# EAGLE schematic Joulev2_RealTime (EAGLE 8.1.1)

## Sheet 1 of 3
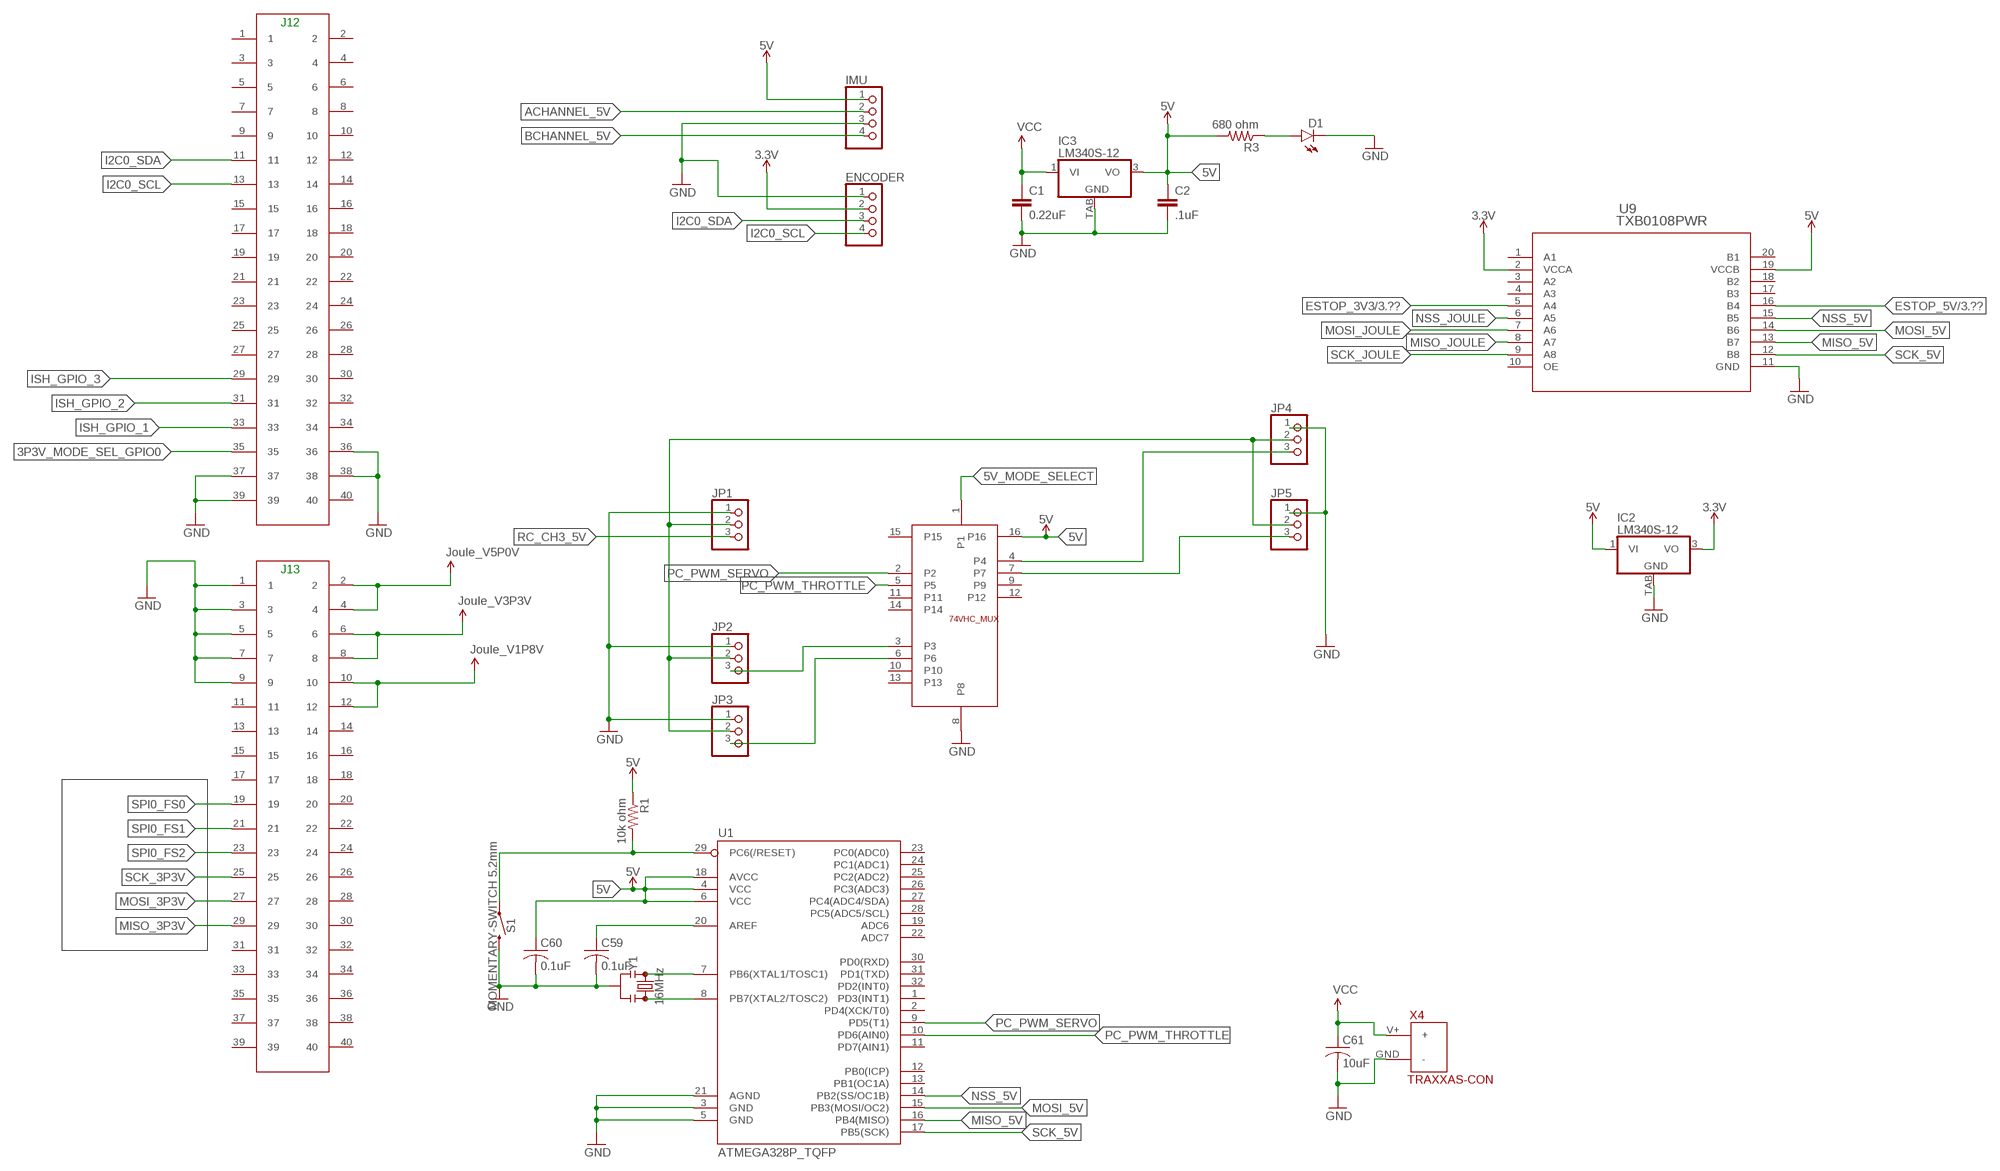
[diagram p0: schematic, sheet 1]

### Parts
C1  0.22uF  0.22UF-25V-10%(0603)  [0603-CAP]
C2  .1uF  0.22UF-25V-10%(0603)  [0603-CAP]
C59  0.1uF  C-USC0603  [C0603]
C60  0.1uF  C-USC0603  [C0603]
C61  10uF  C-USC0603  [C0603]
D1  LED0603  [LED-0603]
ENCODER  PINHD-1X4  [1X04]
IC2  LM340S-12  [TO263-3]
IC3  LM340S-12  [TO263-3]
IMU  PINHD-1X4  [1X04]
JP1  PINHD-1X3  [1X03]
JP2  PINHD-1X3  [1X03]
JP3  PINHD-1X3  [1X03]
JP4  PINHD-1X3  [1X03]
JP5  PINHD-1X3  [1X03]
R1  10k ohm  R-US_R0603  [R0603]
R3  680 ohm  R-US_R0603  [R0603]
S1  MOMENTARY-SWITCH 5.2mm  MOMENTARY-SWITCH-SPST-SMD-5.2MM  [TACTILE_SWITCH_SMD_5.2MM]
U1  ATMEGA328P_TQFP  [TQFP32-08]
U2  74VHC_MUXSO16  [SO16]
U9  TXB0108PWR  [PW20]
X1  J12HEADER_(JOULE)  [2X20]
X2  J13HEADER_(JOULE)  [2X20]
X4  TRAXXAS-CON  [TRAXXAS-CON]
Y1  16MHz  RESONATOR-16MHZSMD_3.2X1.3  [RESONATOR-SMD-3.2X1.3]

### Nets
3.3V: ENCODER.2 IC2.3(VO) U9.2(VCCA) ; also sheet 2,3
3P3V_MODE_SEL_GPIO0: X1.35
5V: C2.1 C60.1 IC2.1(VI) IC3.3(VO) IMU.1 R1.1 R3.2 U1.4(VCC) U1.6(VCC) U1.18(AVCC) U2.16 U9.19(VCCB)
5V_MODE_SELECT: U2.1
ACHANNEL_5V: IMU.2
BCHANNEL_5V: IMU.4
ESTOP_3V3: U9.5(A4) ; also sheet 3
ESTOP_5V: U9.16(B4) ; also sheet 3
GND: C1.2 C2.2 C59.2 C60.2 C61.2 D1.C ENCODER.1 IC2.TAB(GND) IC3.TAB(GND) IMU.3 JP1.1 JP2.1 JP3.1 JP4.1 JP5.1 S1.3 U1.3(GND) U1.5(GND) U1.21(AGND) U2.8 U9.11(GND) X1.36 X1.37 X1.38 X1.39 X2.1 X2.3 X2.5 X2.7 X2.9 X4.GND(-) Y1.2 ; also sheet 2,3
I2C0_SCL: ENCODER.4 X1.13
I2C0_SDA: ENCODER.3 X1.11
ISH_GPIO_1: X1.33
ISH_GPIO_2: X1.31
ISH_GPIO_3: X1.29
MISO_3P3V: X2.29
MISO_5V: U1.16(PB4(MISO)) U9.13(B7)
MISO_JOULE: U9.8(A7)
MOSI_3P3V: X2.27
MOSI_5V: U1.15(PB3(MOSI/OC2)) U9.14(B6)
MOSI_JOULE: U9.7(A6)
N$2: JP4.3 U2.4
N$3: JP5.3 U2.7
N$4: R1.2 S1.1 U1.29(PC6(/RESET))
N$6: U1.7(PB6(XTAL1/TOSC1)) Y1.1
N$7: JP1.2 JP2.2 JP3.2 JP4.2 JP5.2
N$8: U1.8(PB7(XTAL2/TOSC2)) Y1.3
N$10: JP2.3 U2.3
N$11: JP3.3 U2.6
N$13: C59.1 U1.20(AREF)
N$20: D1.A R3.1
NSS_5V: U1.14(PB2(SS/OC1B)) U9.15(B5)
NSS_JOULE: U9.6(A5)
PC_PWM_SERVO: U1.9(PD5(T1)) U2.2
PC_PWM_THROTTLE: U1.10(PD6(AIN0)) U2.5
RC_CH3_5V: JP1.3
SCK_3P3V: X2.25
SCK_5V: U1.17(PB5(SCK)) U9.12(B8)
SCK_JOULE: U9.9(A8)
SPI0_FS0: X2.19
SPI0_FS1: X2.21
SPI0_FS2: X2.23
V1P8V: X2.10 X2.12 ; supply symbol labelled Joule_V1P8V
V3P3V: X2.6 X2.8 ; supply symbol labelled Joule_V3P3V
V5P0V: X2.2 X2.4 ; supply symbol labelled Joule_V5P0V
VCC: C1.1 C61.1 IC3.1(VI) X4.V+(+) ; also sheet 3
Unconnected: U1.1(PD3(INT1)) U1.2(PD4(XCK/T0)) U1.11(PD7(AIN1)) U1.12(PB0(ICP)) U1.13(PB1(OC1A)) U1.19(ADC6) U1.22(ADC7) U1.23(PC0(ADC0)) U1.24(PC1(ADC1)) U1.25(PC2(ADC2)) U1.26(PC3(ADC3)) U1.27(PC4(ADC4/SDA)) U1.28(PC5(ADC5/SCL)) U1.30(PD0(RXD)) U1.31(PD1(TXD)) U1.32(PD2(INT0)) U2.9 U2.10 U2.11 U2.12 U2.13 U2.14 U2.15 U9.1(A1) U9.3(A2) U9.4(A3) U9.10(OE) U9.17(B3) U9.18(B2) U9.20(B1) X1.1 X1.2 X1.3 X1.4 X1.5 X1.6 X1.7 X1.8 X1.9 X1.10 X1.12 X1.14 X1.15 X1.16 X1.17 X1.18 X1.19 X1.20 X1.21 X1.22 X1.23 X1.24 X1.25 X1.26 X1.27 X1.28 X1.30 X1.32 X1.34 X1.40 X2.11 X2.13 X2.14 X2.15 X2.16 X2.17 X2.18 X2.20 X2.22 X2.24 X2.26 X2.28 X2.30 X2.31 X2.32 X2.33 X2.34 X2.35 X2.36 X2.37 X2.38 X2.39 X2.40

### Notes on the sheet
- J12
- J13

## Sheet 2 of 3
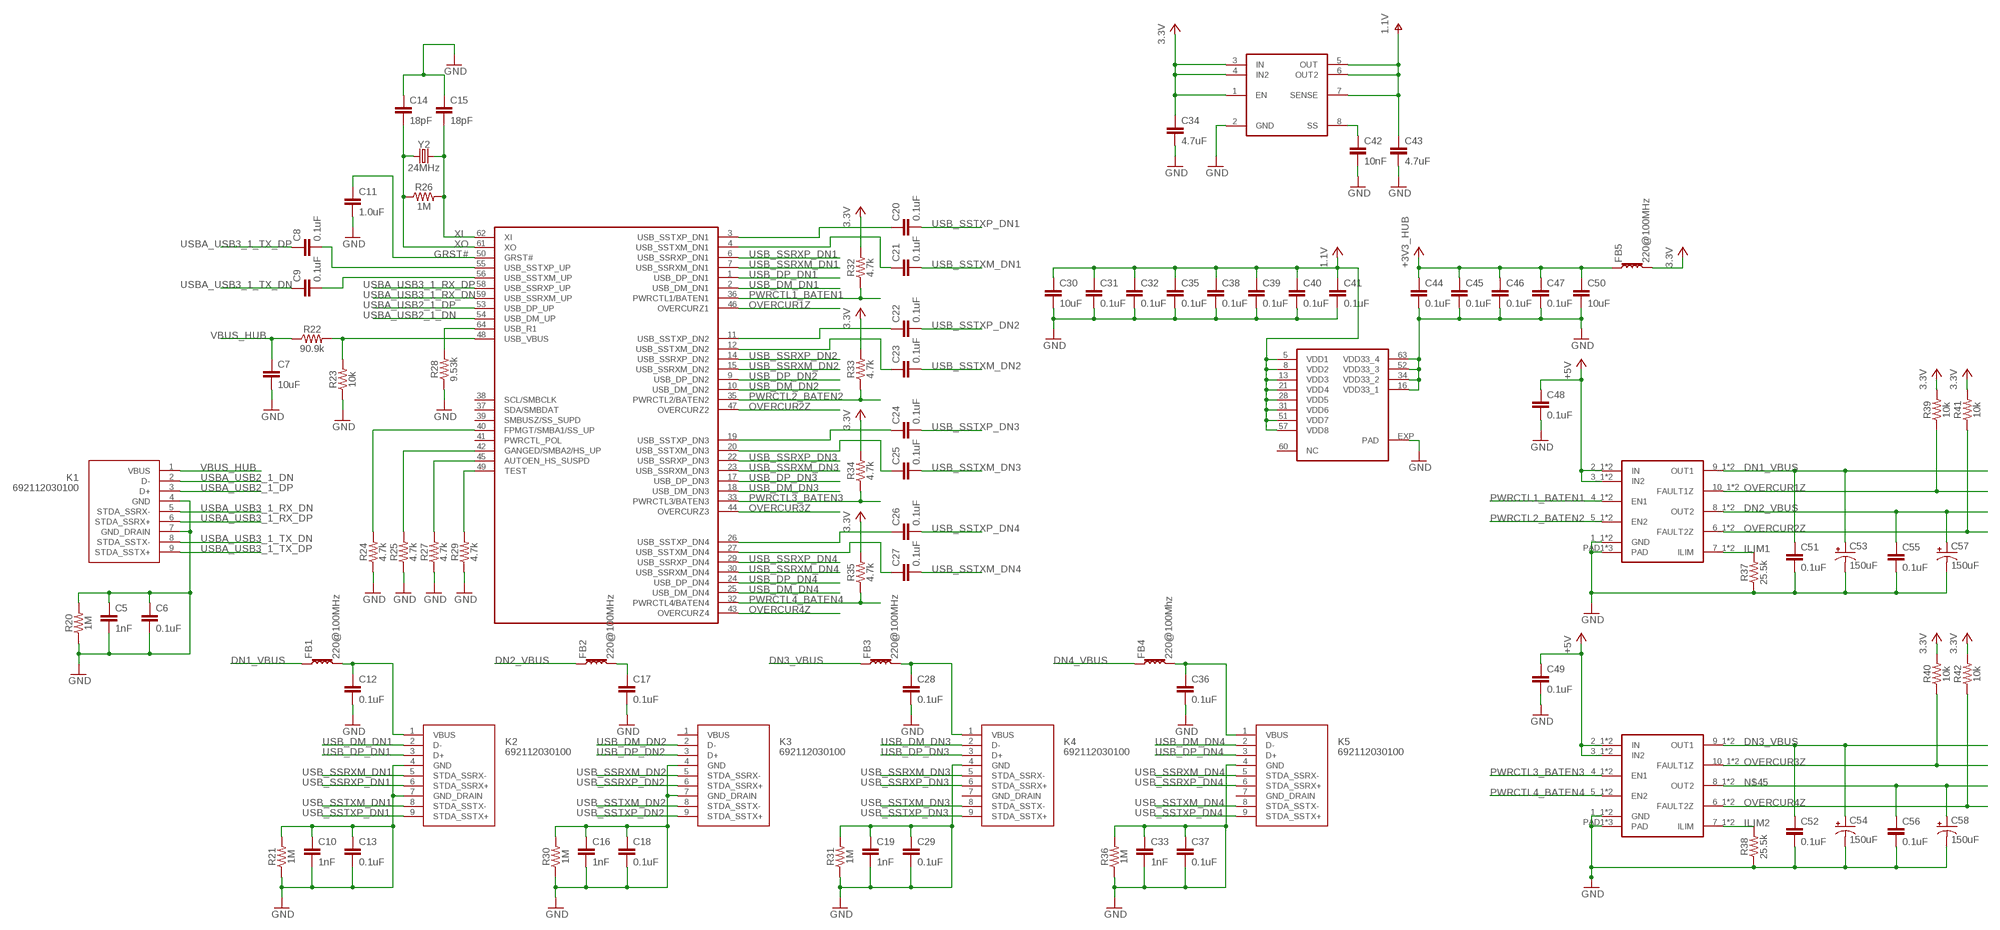
[diagram p1: schematic, sheet 2]

### Parts
C5  1nF  1.0NF/1000PF-0603-50V-10%  [0603]
C6  0.1uF  0.1UF-0603-25V-(+80/-20%)  [0603]
C7  10uF  10UF-0603-6.3V-20%  [0603]
C8  0.1uF  0.1UF-0603-25V-(+80/-20%)  [0603]
C9  0.1uF  0.1UF-0603-25V-(+80/-20%)  [0603]
C10  1nF  1.0NF/1000PF-0603-50V-10%  [0603]
C11  1.0uF  1.0UF-0603-16V-10%  [0603]
C12  0.1uF  0.1UF-0603-25V-(+80/-20%)  [0603]
C13  0.1uF  0.1UF-0603-25V-(+80/-20%)  [0603]
C14  18pF  18PF-0603-50V-5%  [0603]
C15  18pF  18PF-0603-50V-5%  [0603]
C16  1nF  1.0NF/1000PF-0603-50V-10%  [0603]
C17  0.1uF  0.1UF-0603-25V-(+80/-20%)  [0603]
C18  0.1uF  0.1UF-0603-25V-(+80/-20%)  [0603]
C19  1nF  1.0NF/1000PF-0603-50V-10%  [0603]
C20  0.1uF  0.1UF-0603-25V-(+80/-20%)  [0603]
C21  0.1uF  0.1UF-0603-25V-(+80/-20%)  [0603]
C22  0.1uF  0.1UF-0603-25V-(+80/-20%)  [0603]
C23  0.1uF  0.1UF-0603-25V-(+80/-20%)  [0603]
C24  0.1uF  0.1UF-0603-25V-(+80/-20%)  [0603]
C25  0.1uF  0.1UF-0603-25V-(+80/-20%)  [0603]
C26  0.1uF  0.1UF-0603-25V-(+80/-20%)  [0603]
C27  0.1uF  0.1UF-0603-25V-(+80/-20%)  [0603]
C28  0.1uF  0.1UF-0603-25V-(+80/-20%)  [0603]
C29  0.1uF  0.1UF-0603-25V-(+80/-20%)  [0603]
C30  10uF  10UF-0603-6.3V-20%  [0603]
C31  0.1uF  0.1UF-0603-25V-(+80/-20%)  [0603]
C32  0.1uF  0.1UF-0603-25V-(+80/-20%)  [0603]
C33  1nF  1.0NF/1000PF-0603-50V-10%  [0603]
C34  4.7uF  4.7UF0603  [0603]
C35  0.1uF  0.1UF-0603-25V-(+80/-20%)  [0603]
C36  0.1uF  0.1UF-0603-25V-(+80/-20%)  [0603]
C37  0.1uF  0.1UF-0603-25V-(+80/-20%)  [0603]
C38  0.1uF  0.1UF-0603-25V-(+80/-20%)  [0603]
C39  0.1uF  0.1UF-0603-25V-(+80/-20%)  [0603]
C40  0.1uF  0.1UF-0603-25V-(+80/-20%)  [0603]
C41  0.1uF  0.1UF-0603-25V-(+80/-20%)  [0603]
C42  10nF  10NF-0603-50V-10%  [0603]
C43  4.7uF  4.7UF0603  [0603]
C44  0.1uF  0.1UF-0603-25V-(+80/-20%)  [0603]
C45  0.1uF  0.1UF-0603-25V-(+80/-20%)  [0603]
C46  0.1uF  0.1UF-0603-25V-(+80/-20%)  [0603]
C47  0.1uF  0.1UF-0603-25V-(+80/-20%)  [0603]
C48  0.1uF  0.1UF-0603-25V-(+80/-20%)  [0603]
C49  0.1uF  0.1UF-0603-25V-(+80/-20%)  [0603]
C50  10uF  10UF-0603-6.3V-20%  [0603]
C51  0.1uF  0.1UF-0603-25V-(+80/-20%)  [0603]
C52  0.1uF  0.1UF-0603-25V-(+80/-20%)  [0603]
C53  150uF  100UF-POLAR-RADIAL-2.5MM-25V-20%  [CPOL-RADIAL-2.5MM-6.5MM]
C54  150uF  100UF-POLAR-RADIAL-2.5MM-25V-20%  [CPOL-RADIAL-2.5MM-6.5MM]
C55  0.1uF  0.1UF-0603-25V-(+80/-20%)  [0603]
C56  0.1uF  0.1UF-0603-25V-(+80/-20%)  [0603]
C57  150uF  100UF-POLAR-RADIAL-2.5MM-25V-20%  [CPOL-RADIAL-2.5MM-6.5MM]
C58  150uF  100UF-POLAR-RADIAL-2.5MM-25V-20%  [CPOL-RADIAL-2.5MM-6.5MM]
FB1  220@100MHz  FERRITE_BEAD-0603  [0603]
FB2  220@100MHz  FERRITE_BEAD-0603  [0603]
FB3  220@100MHz  FERRITE_BEAD-0603  [0603]
FB4  220@100Mhz  FERRITE_BEAD-0603  [0603]
FB5  220@100MHz  FERRITE_BEAD-0603  [0603]
K1  692112030100  [692112030100]
K2  692112030100  [692112030100]
K3  692112030100  [692112030100]
K4  692112030100  [692112030100]
K5  692112030100  [692112030100]
R20  1M  1MOHM-0603-1/4W-5%  [0603]
R21  1M  1MOHM-0603-1/4W-5%  [0603]
R22  90.9k  100KOHM-0603-1/10W-1%  [0603]
R23  10k  10KOHM-0603-1/10W-1%  [0603]
R24  4.7k  4.7KOHM-0603-1/10W-1%  [0603]
R25  4.7k  4.7KOHM-0603-1/10W-1%  [0603]
R26  1M  1MOHM-0603-1/4W-5%  [0603]
R27  4.7k  4.7KOHM-0603-1/10W-1%  [0603]
R28  9.53k  9.76KOHM-0603-1/10W-1%  [0603]
R29  4.7k  4.7KOHM-0603-1/10W-1%  [0603]
R30  1M  1MOHM-0603-1/4W-5%  [0603]
R31  1M  1MOHM-0603-1/4W-5%  [0603]
R32  4.7k  4.7KOHM-0603-1/10W-1%  [0603]
R33  4.7k  4.7KOHM-0603-1/10W-1%  [0603]
R34  4.7k  4.7KOHM-0603-1/10W-1%  [0603]
R35  4.7k  4.7KOHM-0603-1/10W-1%  [0603]
R36  1M  1MOHM-0603-1/4W-5%  [0603]
R37  25.5k  26.7KOHM0603-1/10W-1%  [0603]
R38  25.5k  26.7KOHM0603-1/10W-1%  [0603]
R39  10k  10KOHM-0603-1/10W-1%  [0603]
R40  10k  10KOHM-0603-1/10W-1%  [0603]
R41  10k  10KOHM-0603-1/10W-1%  [0603]
R42  10k  10KOHM-0603-1/10W-1%  [0603]
U4  TUSB8041  [QFN64-9X9]
U5  ADP1706ARDZ-1.1-R7  [SOIC8]
U6  TPS2561DRCT  [10-VSON]
U7  TPS2561DRCT  [10-VSON]
Y2  24MHz  CRYSTAL-24MHZ"  [CRYSTAL-SMD-5X3.2-4PAD]

### Nets
1.1V: C30.1 C31.1 C32.1 C35.1 C38.1 C39.1 C40.1 C41.1 C43.1 U4.5(VDD1) U4.8(VDD2) U4.13(VDD3) U4.21(VDD4) U4.28(VDD5) U4.31(VDD6) U4.51(VDD7) U4.57(VDD8) U5.5(OUT) U5.6(OUT2) U5.7(SENSE)
3.3V: C34.1 FB5.2 R32.2 R33.2 R34.2 R35.2 R39.2 R40.2 R41.2 R42.2 U5.1(EN) U5.3(IN) U5.4(IN2) ; also sheet 1,3
+3V3_HUB: C44.1 C45.1 C46.1 C47.1 C50.1 FB5.1
+5V: C48.1 C49.1 U6.2_1(IN) U6.2_2(IN) U6.3_1(IN2) U6.3_2(IN2) U7.2_1(IN) U7.2_2(IN) U7.3_1(IN2) U7.3_2(IN2)
DN1_VBUS: C51.1 C53.1(+) FB1.1 U6.9_1(OUT1) U6.9_2(OUT1)
DN2_VBUS: C55.1 C57.1(+) FB2.1 U6.8_1(OUT2) U6.8_2(OUT2)
DN3_VBUS: C52.1 C54.1(+) FB3.1 U7.9_1(OUT1) U7.9_2(OUT1)
DN4_VBUS: FB4.1
GND: C5.1 C5.2 C6.1 C6.2 C7.2 C10.1 C10.2 C11.2 C12.2 C13.1 C13.2 C14.1 C15.1 C16.1 C16.2 C17.2 C18.1 C18.2 C19.1 C19.2 C28.2 C29.1 C29.2 C30.2 C31.2 C32.2 C33.1 C33.2 C34.2 C35.2 C36.2 C37.1 C37.2 C38.2 C39.2 C40.2 C41.2 C42.2 C43.2 C44.2 C45.2 C46.2 C47.2 C48.2 C49.2 C50.2 C51.2 C52.2 C53.2(-) C54.2(-) C55.2 C56.2 C57.2(-) C58.2(-) K1.4(GND) K1.7(GND_DRAIN) K2.4(GND) K2.7(GND_DRAIN) K3.4(GND) K3.7(GND_DRAIN) K4.4(GND) K5.4(GND) R20.1 R20.2 R21.1 R21.2 R23.1 R24.1 R25.1 R27.1 R28.1 R29.1 R30.1 R30.2 R31.1 R31.2 R36.1 R36.2 R37.1 R38.1 U4.16(VDD33_1) U4.34(VDD33_2) U4.52(VDD33_3) U4.63(VDD33_4) U4.EXP(PAD) U5.2(GND) U6.1_1(GND) U6.1_2(GND) U6.PAD1(PAD) U6.PAD2(PAD) U6.PAD3(PAD) U7.1_1(GND) U7.1_2(GND) U7.PAD1(PAD) U7.PAD2(PAD) U7.PAD3(PAD) ; also sheet 1,3
GRST#: C11.1 U4.50(GRST#)
ILIM1: R37.2 U6.7_1(ILIM) U6.7_2(ILIM)
ILIM2: R38.2 U7.7_1(ILIM) U7.7_2(ILIM)
N$9: R28.2 U4.64(USB_R1)
N$18: R29.2 U4.49(TEST)
N$22: R27.2 U4.45(AUTOEN_HS_SUSPD)
N$23: R25.2 U4.42(GANGED/SMBA2/HS_UP)
N$24: R24.2 U4.40(FPMGT/SMBA1/SS_UP)
N$25: R22.2 R23.2 U4.48(USB_VBUS)
N$26: C27.1 U4.27(USB_SSTXM_DN4)
N$27: C26.1 U4.26(USB_SSTXP_DN4)
N$28: C25.1 U4.20(USB_SSTXM_DN3)
N$29: C24.1 U4.19(USB_SSTXP_DN3)
N$30: C23.1 U4.12(USB_SSTXM_DN2)
N$31: C22.1 U4.11(USB_SSTXP_DN2)
N$32: C21.1 U4.4(USB_SSTXM_DN1)
N$33: C20.1 U4.3(USB_SSTXP_DN1)
N$35: C12.1 FB1.2 K2.1(VBUS)
N$36: C42.1 U5.8(SS)
N$38: C17.1 FB2.2
N$40: C28.1 FB3.2 K4.1(VBUS)
N$45: C56.1 C58.1(+) U7.8_1(OUT2) U7.8_2(OUT2)
N$73: C36.1 FB4.2 K5.1(VBUS)
OVERCUR1Z: R39.1 U4.46(OVERCURZ1) U6.10_1(FAULT1Z) U6.10_2(FAULT1Z)
OVERCUR2Z: R41.1 U4.47(OVERCURZ2) U6.6_1(FAULT2Z) U6.6_2(FAULT2Z)
OVERCUR3Z: R40.1 U4.44(OVERCURZ3) U7.10_1(FAULT1Z) U7.10_2(FAULT1Z)
OVERCUR4Z: R42.1 U4.43(OVERCURZ4) U7.6_1(FAULT2Z) U7.6_2(FAULT2Z)
PWRCTL1_BATEN1: R32.1 U4.36(PWRCTL1/BATEN1) U6.4_1(EN1) U6.4_2(EN1)
PWRCTL2_BATEN2: R33.1 U4.35(PWRCTL2/BATEN2) U6.5_1(EN2) U6.5_2(EN2)
PWRCTL3_BATEN3: R34.1 U4.33(PWRCTL3/BATEN3) U7.4_1(EN1) U7.4_2(EN1)
PWRCTL4_BATEN4: R35.1 U4.32(PWRCTL4/BATEN4) U7.5_1(EN2) U7.5_2(EN2)
USB_DM_DN1: K2.2(D-) U4.2(USB_DM_DN1)
USB_DM_DN2: K3.2(D-) U4.10(USB_DM_DN2)
USB_DM_DN3: K4.2(D-) U4.18(USB_DM_DN3)
USB_DM_DN4: K5.2(D-) U4.25(USB_DM_DN4)
USB_DP_DN1: K2.3(D+) U4.1(USB_DP_DN1)
USB_DP_DN2: K3.3(D+) U4.9(USB_DP_DN2)
USB_DP_DN3: K4.3(D+) U4.17(USB_DP_DN3)
USB_DP_DN4: K5.3(D+) U4.24(USB_DP_DN4)
USB_SSRXM_DN1: K2.5(STDA_SSRX-) U4.7(USB_SSRXM_DN1)
USB_SSRXM_DN2: K3.5(STDA_SSRX-) U4.15(USB_SSRXM_DN2)
USB_SSRXM_DN3: K4.5(STDA_SSRX-) U4.23(USB_SSRXM_DN3)
USB_SSRXM_DN4: K5.5(STDA_SSRX-) U4.30(USB_SSRXM_DN4)
USB_SSRXP_DN1: K2.6(STDA_SSRX+) U4.6(USB_SSRXP_DN1)
USB_SSRXP_DN2: K3.6(STDA_SSRX+) U4.14(USB_SSRXP_DN2)
USB_SSRXP_DN3: K4.6(STDA_SSRX+) U4.22(USB_SSRXP_DN3)
USB_SSRXP_DN4: K5.6(STDA_SSRX+) U4.29(USB_SSRXP_DN4)
USB_SSTXM_DN1: C21.2 K2.8(STDA_SSTX-)
USB_SSTXM_DN2: C23.2 K3.8(STDA_SSTX-)
USB_SSTXM_DN3: C25.2 K4.8(STDA_SSTX-)
USB_SSTXM_DN4: C27.2 K5.8(STDA_SSTX-)
USB_SSTXP_DN1: C20.2 K2.9(STDA_SSTX+)
USB_SSTXP_DN2: C22.2 K3.9(STDA_SSTX+)
USB_SSTXP_DN3: C24.2 K4.9(STDA_SSTX+)
USB_SSTXP_DN4: C26.2 K5.9(STDA_SSTX+)
USBA_USB2_1_DN: K1.2(D-) U4.54(USB_DM_UP)
USBA_USB2_1_DP: K1.3(D+) U4.53(USB_DP_UP)
USBA_USB3_1_RX_DN: K1.5(STDA_SSRX-) U4.59(USB_SSRXM_UP)
USBA_USB3_1_RX_DP: K1.6(STDA_SSRX+) U4.58(USB_SSRXP_UP)
USBA_USB3_1_TX_DN: C9.1 K1.8(STDA_SSTX-)
USBA_USB3_1_TX_DP: C8.1 K1.9(STDA_SSTX+)
VBUS_HUB: C7.1 K1.1(VBUS) R22.1
X: C8.2 U4.55(USB_SSTXP_UP)
XI: C15.2 R26.2 U4.62(XI) Y2.3
XO: C14.2 R26.1 U4.61(XO) Y2.1
Y: C9.2 U4.56(USB_SSTXM_UP)
Unconnected: K3.1(VBUS) K4.7(GND_DRAIN) K5.7(GND_DRAIN) U4.37(SDA/SMBDAT) U4.38(SCL/SMBCLK) U4.39(SMBUSZ/SS_SUPD) U4.41(PWRCTL_POL) U4.60(NC)

## Sheet 3 of 3: E-stop
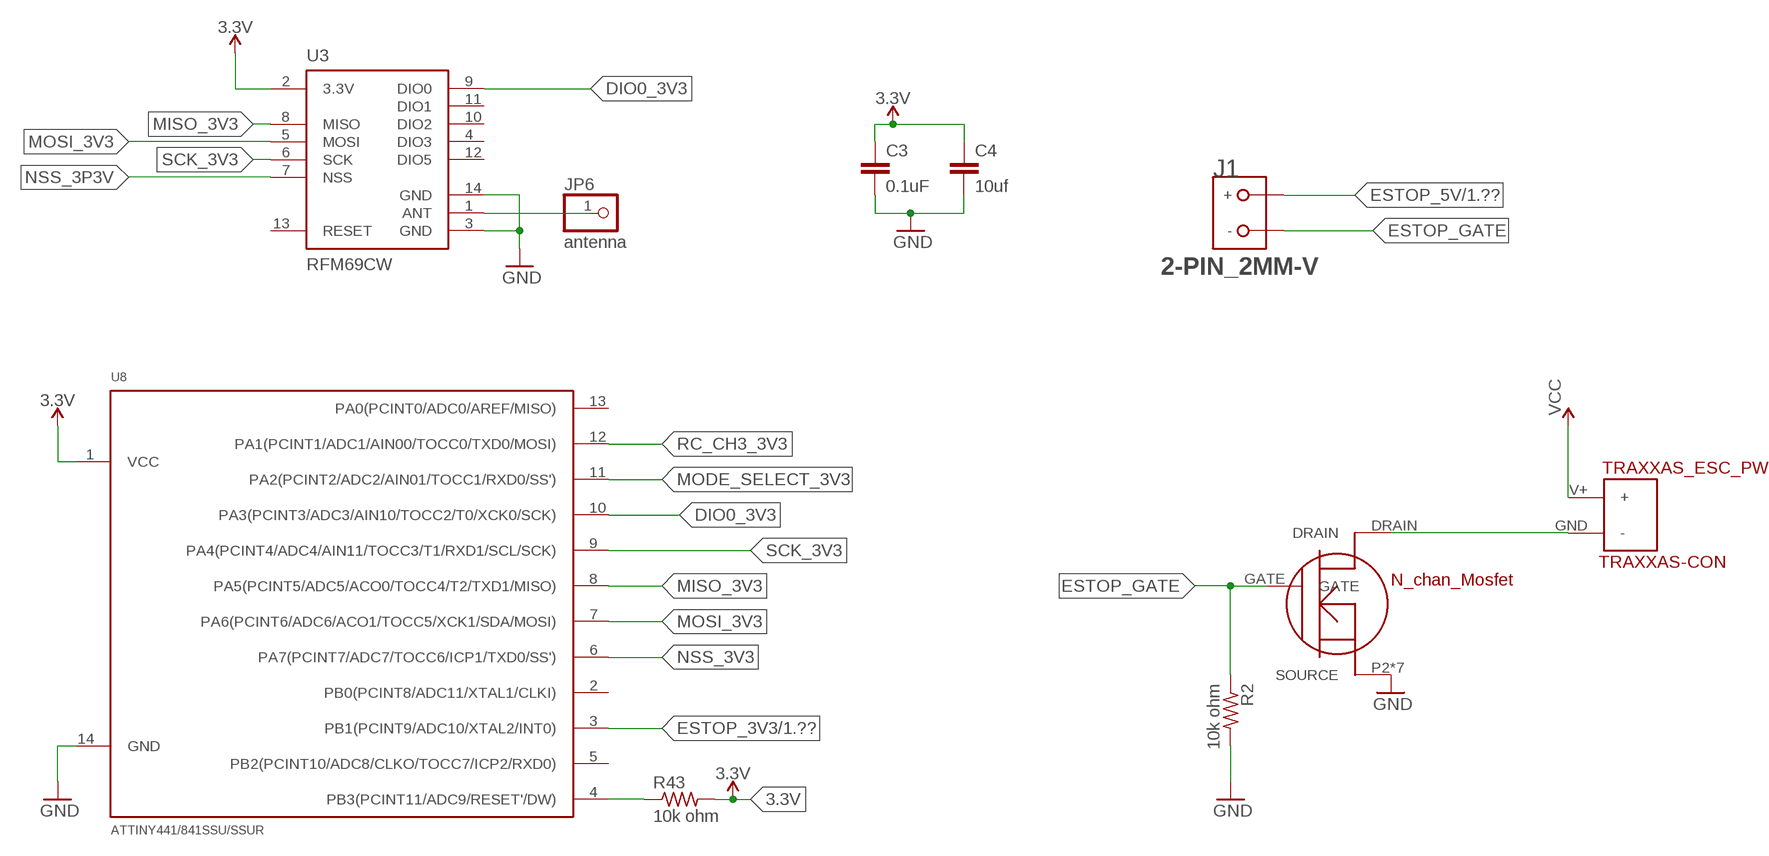
[diagram p2: schematic, sheet 3]

### Parts
C3  0.1uF  0.1UF-25V(+80/-20%)(0603)  [0603-CAP]
C4  10uf  2.2UF-25V-+80/-20(0805)  [0805@1]
J1  2-PIN_2MM-V  [2MM-2-V]
JP6  antenna  PINHD-1X1  [1X01]
Q1  N_CH_MOSFET_FDLBL260N100  [MO-299A]
R2  10k ohm  R-US_R0603  [R0603]
R43  10k ohm  R-US_R0603  [R0603]
TRAXXAS_ESC_PWR  TRAXXAS-CON  [TRAXXAS-CON]
U3  RFM69CW  [RFM69CW-XXXS2]
U8  ATTINY441/841SSU/SSUR  [SOIC-14]

### Nets
3.3V: C3.1 C4.1 R43.2 U3.2(3.3V) U8.1(VCC) ; also sheet 1,2
DIO0_3V3: U3.9(DIO0) U8.10(PA3(PCINT3/ADC3/AIN10/TOCC2/T0/XCK0/SCK))
ESTOP_3V3: U8.3(PB1(PCINT9/ADC10/XTAL2/INT0)) ; also sheet 1
ESTOP_5V: J1.1(+) ; also sheet 1
ESTOP_GATE: J1.2(-) Q1.GATE R2.1
GND: C3.2 C4.2 Q1.P2(SOURCE) Q1.P3(SOURCE) Q1.P4(SOURCE) Q1.P5(SOURCE) Q1.P6(SOURCE) Q1.P7(SOURCE) Q1.P8(SOURCE) R2.2 U3.3(GND) U3.14(GND) U8.14(GND) ; also sheet 1,2
MISO_3V3: U3.8(MISO)
MODE_SELECT_3V3: U8.11(PA2(PCINT2/ADC2/AIN01/TOCC1/RXD0/SS'))
MOSI_3V3: U3.5(MOSI)
N$1: JP6.1 U3.1(ANT)
N$5: TRAXXAS_ESC_PWR.GND(-)
N$12: R43.1 U8.4(PB3(PCINT11/ADC9/RESET'/DW))
NSS_3P3V: U3.7(NSS)
RC_CH3_3V3: U8.12(PA1(PCINT1/ADC1/AIN00/TOCC0/TXD0/MOSI))
SCK_3V3: U3.6(SCK)
VCC: TRAXXAS_ESC_PWR.V+(+) ; also sheet 1
Unconnected: Q1.DRAIN U3.4(DIO3) U3.10(DIO2) U3.11(DIO1) U3.12(DIO5) U3.13(RESET) U8.2(PB0(PCINT8/ADC11/XTAL1/CLKI)) U8.5(PB2(PCINT10/ADC8/CLKO/TOCC7/ICP2/RXD0)) U8.6(PA7(PCINT7/ADC7/TOCC6/ICP1/TXD0/SS')) U8.7(PA6(PCINT6/ADC6/ACO1/TOCC5/XCK1/SDA/MOSI)) U8.8(PA5(PCINT5/ADC5/ACO0/TOCC4/T2/TXD1/MISO)) U8.9(PA4(PCINT4/ADC4/AIN11/TOCC3/T1/RXD1/SCL/SCK)) U8.13(PA0(PCINT0/ADC0/AREF/MISO))

## Library data of the parts
C1 = SparkFun-Capacitors:0.22UF-25V-10%(0603): CAP-07822; PROD_ID: CAP-07822
C2 = SparkFun-Capacitors:0.22UF-25V-10%(0603): CAP-07822; PROD_ID: CAP-07822; VALUE: 0.22uF
C3 = SparkFun-Capacitors:0.1UF-25V(+80/-20%)(0603): CAP-00810 Ceramic Standard decoupling cap; PROD_ID: CAP-00810
C4 = SparkFun-Capacitors:2.2UF-25V-+80/-20(0805): CAP-11624; PROD_ID: CAP-11624; VALUE: 2.2uF
C5 C10 C16 C19 C33 = SparkFun-Capacitors:1.0NF/1000PF: 1nF/1,000pF ceramic capacitors A capacitor is a passive two-terminal electrical component used to store electrical energy temporarily in an electric field.; PROD_ID: CAP-07886
C6 C8 C9 C12 C13 C17 C18 C20-C29 C31 C32 C35-C41 C44-C49 C51 C52 C55 C56 = SparkFun-Capacitors:0.1UF: 0.1µF ceramic capacitors A capacitor is a passive two-terminal electrical component used to store electrical energy temporarily in an electric field.; PROD_ID: CAP-00810
C7 C30 C50 = SparkFun-Capacitors:10UF: 10.0µF ceramic capacitors A capacitor is a passive two-terminal electrical component used to store electrical energy temporarily in an electric field.; PROD_ID: CAP-11015
C11 = SparkFun-Capacitors:1.0UF: 1µF ceramic capacitors A capacitor is a passive two-terminal electrical component used to store electrical energy temporarily in an electric field.; PROD_ID: CAP-00868
C14 C15 = SparkFun-Capacitors:18PF: 18pF ceramic capacitors A capacitor is a passive two-terminal electrical component used to store electrical energy temporarily in an electric field.; PROD_ID: CAP-08267
C34 C43 = SparkFun-Capacitors:4.7UF: 4.7µF ceramic capacitors A capacitor is a passive two-terminal electrical component used to store electrical energy temporarily in an electric field.; PROD_ID: CAP-08280
C42 = SparkFun-Capacitors:10NF: 0.01uF/10nF/10,000pF ceramic capacitors A capacitor is a passive two-terminal electrical component used to store electrical energy temporarily in an electric field. CAP-09321; PROD_ID: CAP-00867
C53 C54 C57 C58 = SparkFun-Capacitors:100UF-POLAR: 100µF polarized capacitors A capacitor is a passive two-terminal electrical component used to store electrical energy temporarily in an electric field.; PROD_ID: CAP-08439; VALUE: 100uF
C59-C61 = rcl:C-US: CAPACITOR, American symbol
D1 = SparkFun-LED:LED: LEDs Standard schematic elements and footprints for 5mm, 3mm, 1206, and 0603 sized LEDs. 5mm - Spark Fun Electronics SKU : COM-00529 (and others)
ENCODER IMU = pinhead:PINHD-1X4: PIN HEADER
FB1-FB5 = SparkFun-Coils:FERRITE_BEAD: Ferrite Bead (blocks, cores, rings, chokes, etc.) Inductor with layers of ferrite used to suppress high frequencies. Often used to isolate high frequency noise. SparkFun Products: IOIO-OTG - V2.2 <https://www.sparkfun.com/products/13613> SparkFun SAMD21 Mini Breakout <https://www.sparkfun.com/products/13664> SparkFun 6 Degrees of Freedom Breakout - LSM6DS3 <https://www.sparkfun.com/products/13339> SparkFun SAMD21 Dev Breakout <https://www.sparkfun.com/products/13672>; PROD_ID: NDUC-07859; VALUE: 30Ω/1.8A
IC2 IC3 = linear:LM340?-*: Positive VOLTAGE REGULATOR Source: http://cache.national.com/ds/LM/LM340.pdf
J1 = RoboJackets-Connectors:2-PIN_2MM-*; PINS: 2; PIN_PITCH: 2.0 mm
JP1-JP5 = adafruit:PINHD-1X3: PIN HEADER
JP6 = adafruit:PINHD-1X1: Pin header 1x1 for 0.1" spacing With round pins
K1-K5 = Roboracing:692112030100: WR-COM USB 3.0 SMT PLUG WITH CLIPTYPE A
Q1 = Roboracing:N_CH_MOSFET_FDLBL260N100
R1-R3 R43 = rcl:R-US_: RESISTOR, American symbol
R20 R21 R26 R30 R31 R36 = SparkFun-Resistors:1MOHM: 1MΩ resistor A resistor is a passive two-terminal electrical component that implements electrical resistance as a circuit element. Resistors act to reduce current flow, and, at the same time, act to lower voltage levels within circuits. - Wikipedia; PROD_ID: RES-07868
R22 = SparkFun-Resistors:100KOHM: 100kΩ resistor A resistor is a passive two-terminal electrical component that implements electrical resistance as a circuit element. Resistors act to reduce current flow, and, at the same time, act to lower voltage levels within circuits. - Wikipedia; PROD_ID: RES-07828; VALUE: 100k
R23 R39-R42 = SparkFun-Resistors:10KOHM: 10kΩ resistor A resistor is a passive two-terminal electrical component that implements electrical resistance as a circuit element. Resistors act to reduce current flow, and, at the same time, act to lower voltage levels within circuits. - Wikipedia; PROD_ID: RES-00824
R24 R25 R27 R29 R32-R35 = SparkFun-Resistors:4.7KOHM: 4.7kΩ resistor A resistor is a passive two-terminal electrical component that implements electrical resistance as a circuit element. Resistors act to reduce current flow, and, at the same time, act to lower voltage levels within circuits. - Wikipedia; PROD_ID: RES-07857
R28 = SparkFun-Resistors:9.76KOHM: 9.76kΩ resistor A resistor is a passive two-terminal electrical component that implements electrical resistance as a circuit element. Resistors act to reduce current flow, and, at the same time, act to lower voltage levels within circuits. - Wikipedia; PROD_ID: RES-12534; VALUE: 9.76k
R37 R38 = SparkFun-Resistors:26.7KOHM: 26.7kΩ resistor A resistor is a passive two-terminal electrical component that implements electrical resistance as a circuit element. Resistors act to reduce current flow, and, at the same time, act to lower voltage levels within circuits. - Wikipedia; PROD_ID: RES-12186; VALUE: 26.7k
S1 = Roboracing:MOMENTARY-SWITCH-SPST: Momentary Switch (Pushbutton) - SPST Normally-open (NO) SPST momentary switches (buttons, pushbuttons). Variants PTH-12MM - 12mm square, through-hole Momentary Pushbutton Switch - 12mm Square <https://www.sparkfun.com/products/9190> (COM-09190) PTH-6.0MM, PTH-6.0MM-KIT - 6.0mm square, through-hole Mini Pushbutton Switch <https://www.sparkfun.com/products/97> (COM-00097) KIT package intended for soldering kit's - only one side of pads' copper is exposed. PTH-RIGHT-ANGLE-KIT - Right-angle, through-hole Right Angle Tactile Button <https://www.sparkfun.com/products/10791> - Used on SparkFun BigTime Watch Kit <https://www.sparkfun.com/products/11734> SMD-12MM - 12mm square, surface-mount Tactile Button - SMD (12mm) <https://www.sparkfun.com/products/12993> (COM-12993) Used on SparkFun PicoBoard <https://www.sparkfun.com/products/11888> SMD-4.5MM - 4.5mm Square Trackball Switch Used on SparkFun Blackberry Trackballer Breakout <https://www.sparkfun.com/products/13169> SMD-4.6MMX2.8MM - 4.60mm x 2.80mm, surface mount Used on SparkFun SAMD21 Mini Breakout <https://www.sparkfun.com/products/13664> SMD-5.2MM, SMD-5.2-REDUNDANT - 5.2mm square, surface-mount Mini Pushbutton Switch - SMD <https://www.sparkfun.com/products/8720> (COM-08720) Used on Arduino Pro Mini <https://www.sparkfun.com/products/11114> REDUNDANT package connects both switch circuits together SMD-6.0X3.5MM - 6.0 x 3.5mm, surface mount Momentary Reset Switch SMD <https://www.sparkfun.com/products/8229> (COM-08229) SMD-6.2MM-TALL - 6.2mm square, surface mount Tactile Button - SMD (6mm) <https://www.sparkfun.com/products/12992> Used on SparkFun Digital Sandbox <https://www.sparkfun.com/products/12651> SMD-RIGHT-ANGLE - Right-angle, surface mount Used on SparkFun Block for Intel® Edison - Arduino <https://www.sparkfun.com/products/13036>; PROD_ID: SWCH-08247; SF_SKU: COM-08720
TRAXXAS_ESC_PWR X4 = Roboracing:TRAXXAS-CON
U1 = SparkFun-IC-Microcontroller:ATMEGA328P_TQFP: Popular 328P in QFP Storefront component: ATmega328 - TQFP <https://www.sparkfun.com/products/13448> (COM-13448) Datasheet <http://www.sparkfun.com/datasheets/Components/SMD/ATMega328.pdf> SparkFun Products SparkFun RedBoard - Programmed with Arduino <https://www.sparkfun.com/products/12757> (DEV-12757) Arduino Pro Mini 328 - 5V/16MHz <https://www.sparkfun.com/products/11113> (DEV-11113) Arduino Pro Mini 328 - 3.3V/8MHz <https://www.sparkfun.com/products/11114> (DEV-11114) SparkFun OpenLog <https://www.sparkfun.com/products/13712> (DEV-13712) SparkFun MicroView - OLED Arduino Module <https://www.sparkfun.com/products/12923> (DEV-12923) SparkFun Digital Sandbox <https://www.sparkfun.com/products/12651> (DEV-12651) SparkFun PicoBoard <https://www.sparkfun.com/products/11888> (WIG-11888) Arduino Fio <https://www.sparkfun.com/products/10116> (DEV-10116) LilyPad Arduino 328 Main Board <https://www.sparkfun.com/products/13342> (DEV-13342) SparkFun RedStick <https://www.sparkfun.com/products/13741> (DEV-13741) LilyPad MP3 <https://www.sparkfun.com/products/11013> (DEV-11013) LilyPad Arduino SimpleSnap <https://www.sparkfun.com/products/10941> (DEV-10941) SparkFun Stepoko <https://www.sparkfun.com/products/13899> (ROB-13899) SparkFun Geiger Counter <https://www.sparkfun.com/products/11345> (SEN-11345) SparkFun EL Sequencer <https://www.sparkfun.com/products/12781> (COM-12781) Arduino Pro 328 - 5V/16MHz <https://www.sparkfun.com/products/10915> (DEV-10915) CryptoCape <https://www.sparkfun.com/products/12773> (DEV-12773) SparkFun IR Thermometer Evaluation Board - MLX90614 <https://www.sparkfun.com/products/10740> (SEN-10740) SparkFun RedBot Mainboard <https://www.sparkfun.com/products/12097> (ROB-12097) Arduino Pro 328 - 3.3V/8MHz <https://www.sparkfun.com/products/10914> (DEV-10914) SparkFun Block for Intel® Edison - Arduino <https://www.sparkfun.com/products/13036> (DEV-13036) SparkFun Simon Says - Surface Mount Soldering Kit <https://www.sparkfun.com/products/10935> (KIT-10935) SparkFun 7-Segment Serial Display - Red <https://www.sparkfun.com/products/11441> (COM-11441) SparkFun 7-Segment Serial Display - White <https://www.sparkfun.com/products/11629> (COM-11629) SparkFun 7-Segment Serial Display - Yellow <https://www.sparkfun.com/products/11443> (COM-11443) SparkFun 7-Segment Serial Display - Kelly Green <https://www.sparkfun.com/products/11440> (COM-11440) SparkFun 7-Segment Serial Display - Blue <https://www.sparkfun.com/products/11442> (COM-11442) SparkFun OpenSegment Serial Display - 20mm (Blue) <https://www.sparkfun.com/products/11647> (COM-11647) SparkFun OpenSegment Serial Display - 20mm (Green) <https://www.sparkfun.com/products/11646> (COM-11646) SparkFun OpenSegment Serial Display - 20mm (White) <https://www.sparkfun.com/products/11648> (COM-11648) SparkFun OpenSegment Serial Display - 20mm (Red) <https://www.sparkfun.com/products/11644> (COM-11644) SparkFun OpenSegment Serial Display - 20mm (Yellow) <https://www.sparkfun.com/products/11645> (COM-11645) SparkFun OpenSegment Shield <https://www.sparkfun.com/products/13190> (DEV-13190); PROD_ID: IC-09069
U2 = Roboracing:74VHC_MUX
U3 = mike-temp:RFM69
U4 = Roboracing:TUSB8041
U5 = Roboracing:ADP1706ARDZ-1.1-R7
U6 U7 = Roboracing:TPS2561DRCT
U8 = rgb-led:ATTINY441/841
U9 = Roboracing:TXB0108PWR; MANUFACTURER_PART_NUMBER: TXB0108PWR; VENDOR: Texas Instruments
X1 = Roboracing:J12HEADER_(JOULE)
X2 = Roboracing:J13HEADER_(JOULE)
Y1 = SparkFun-Clocks:RESONATOR-16MHZ: 16MHz Resonator Digikey Example <http://www.digikey.com/product-detail/en/murata-electronics-north-america/CSTCE16M0V53-R0/490-1198-1-ND/584635> Frequency: 16MHz Frequency Stability: ±0.3% Frequency Tolerance: ±0.5% Capacitance: 15pF SparkFun Products SparkFun OpenLog <https://www.sparkfun.com/products/13712> SparkFun MicroView - OLED Arduino Module <https://www.sparkfun.com/products/12923>; PROD_ID: XTAL-08900
Y2 = SparkFun-Clocks:CRYSTAL-24MHZ: 24MHz Crystal Datasheet <http://www.sparkfun.com/datasheets/Components/AT-SMD-5x3.pdf> Frequency: 24MHz Frequency Tolerance: ±20ppm Load Capacitance: 12pF SparkFun Products: USB Bit Whacker <https://www.sparkfun.com/products/762>; PROD_ID: XTAL-08298; SF_ID: COM-08581